# EAGLE design SRAM 4MB_2.2 (EAGLE 6.5.0)
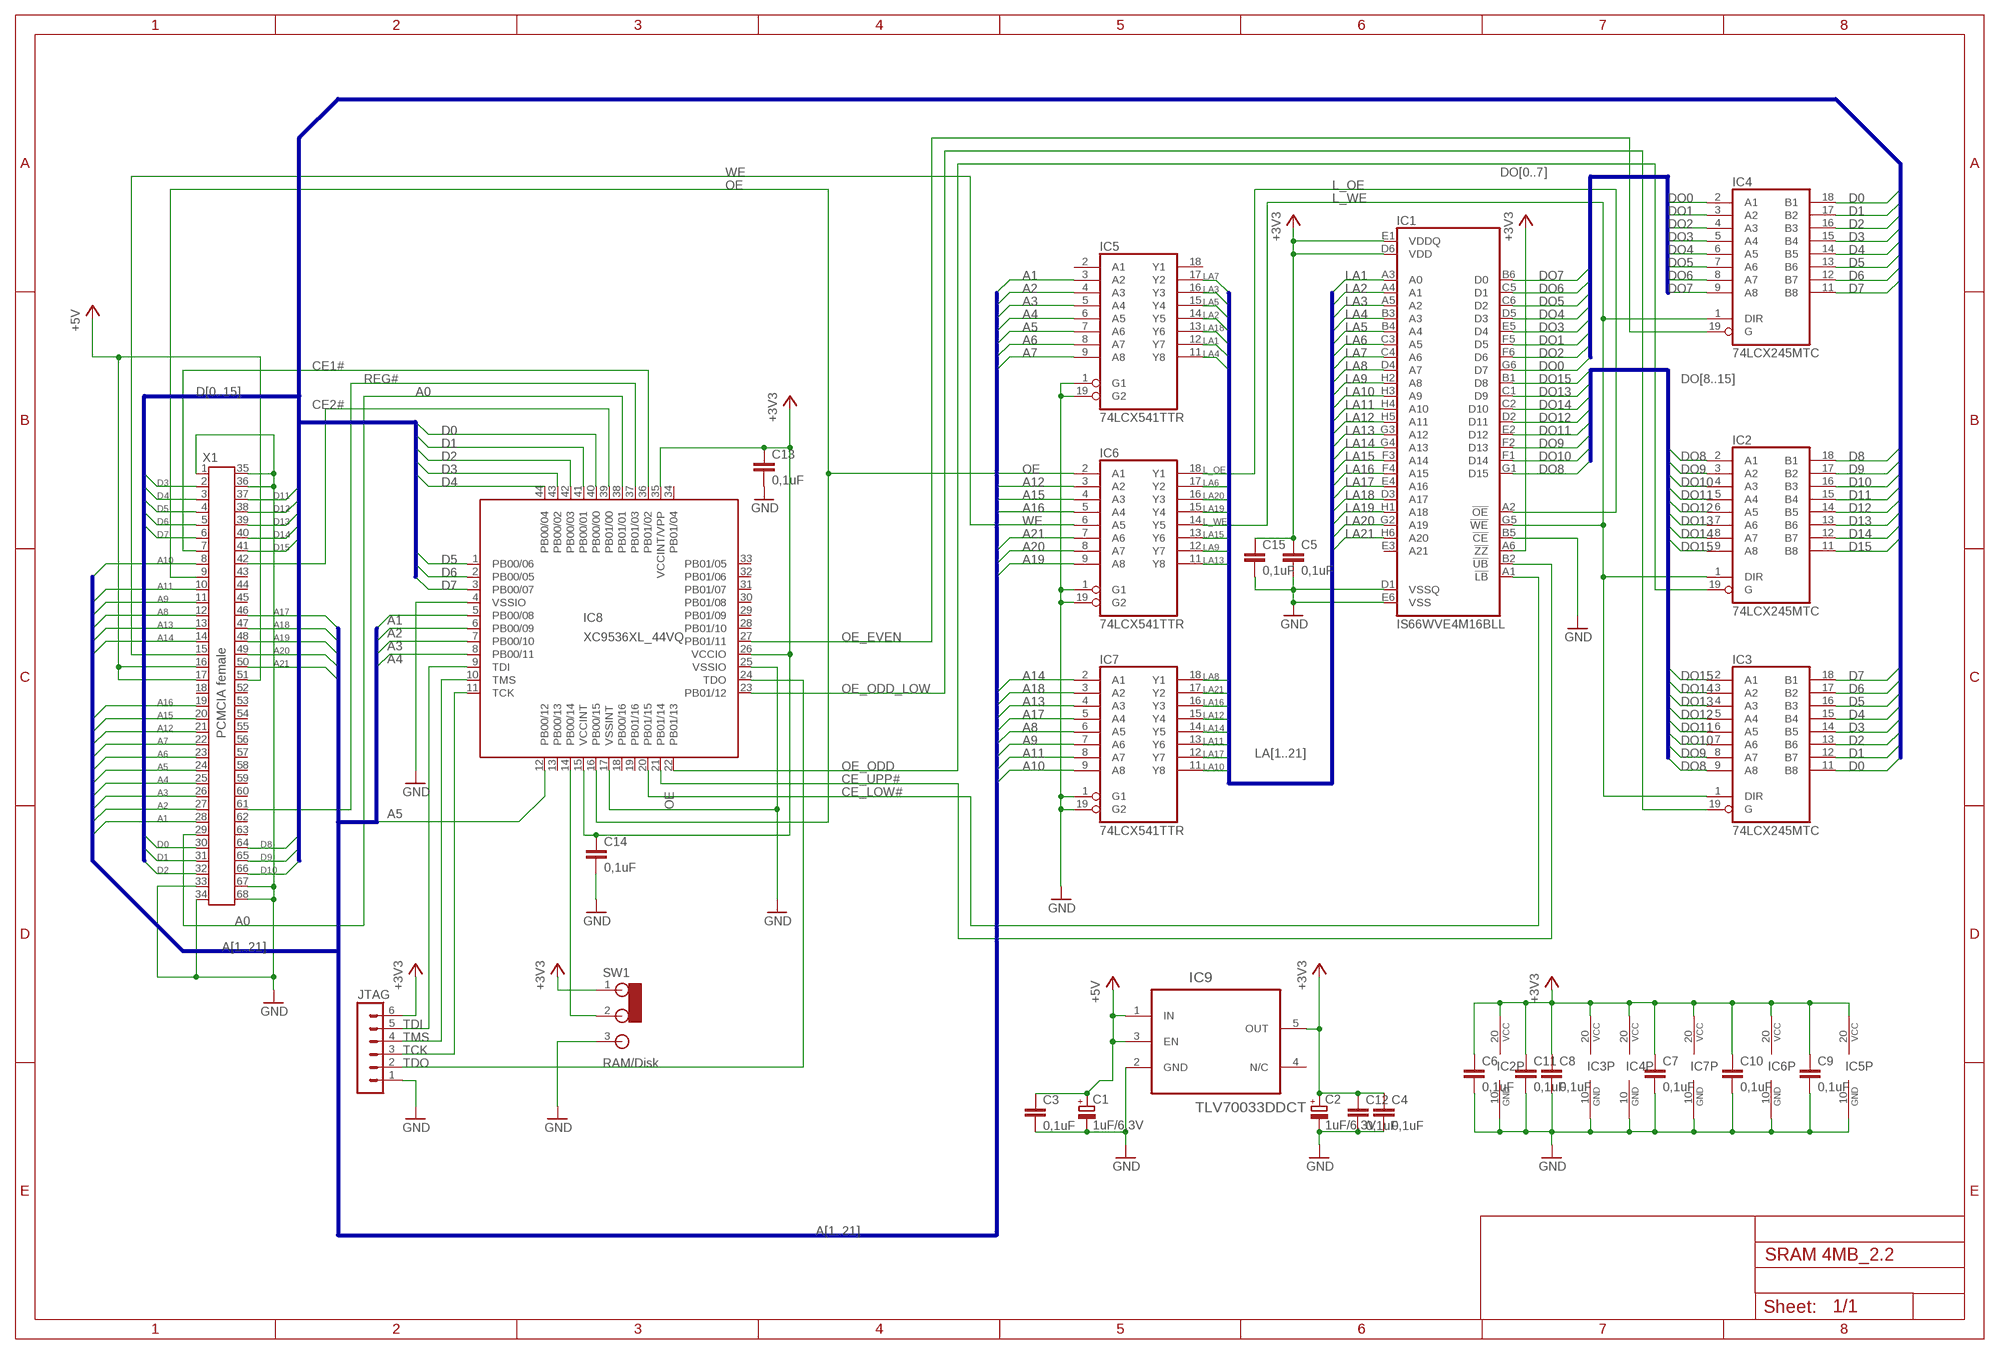
[diagram p0: schematic, sheet 1]

## Parts
C1  1uF/6,3V  CPOL-EUA/3216-18R  [A/3216-18R]
C2  1uF/6,3V  CPOL-EUA/3216-18R  [A/3216-18R]
C3  0,1uF  C-EUC0603  [C0603]
C4  0,1uF  C-EUC0603  [C0603]
C5  0,1uF  C-EUC0402K  [C0402K]
C6  0,1uF  C-EUC0402K  [C0402K]
C7  0,1uF  C-EUC0402K  [C0402K]
C8  0,1uF  C-EUC0402K  [C0402K]
C9  0,1uF  C-EUC0402K  [C0402K]
C10  0,1uF  C-EUC0402K  [C0402K]
C11  0,1uF  C-EUC0402K  [C0402K]
C12  0,1uF  C-EUC0402K  [C0402K]
C13  0,1uF  C-EUC0402K  [C0402K]
C14  0,1uF  C-EUC0402K  [C0402K]
C15  0,1uF  C-EUC0402K  [C0402K]
IC1  IS66WVE4M16BLL  [TFBGA48]
IC2  74LCX245MTC  74LS245MTC  [TSSOP20]
IC3  74LCX245MTC  74LS245MTC  [TSSOP20]
IC4  74LCX245MTC  74LS245MTC  [TSSOP20]
IC5  74LCX541TTR  74541TTR  [TSSOP20]
IC6  74LCX541TTR  74541TTR  [TSSOP20]
IC7  74LCX541TTR  74541TTR  [TSSOP20]
IC8  XC9536XL_44VQ  XC9536_44VQ  [SQFP-S-10X10-44]
IC9  TLV70033DDCT  [SOT95P280X110-5N]
JTAG  MA06-1  [MA06-1]
SW1  RAM/Disk  AYZ0102AGRLC  [SWITCH2]
X1  PCMCIA female  9M681X03TB9M681Z04  [9M681X04]

## Nets
+3V3 [+3.3V]: C2.+ C4.1 C5.1 C6.1 C7.1 C8.1 C9.1 C10.1 C11.1 C12.1 C13.1 C14.1 C15.1 IC1.A6(!ZZ) IC1.D6(VDD) IC1.E1(VDDQ) IC2.20(VCC) IC3.20(VCC) IC4.20(VCC) IC5.20(VCC) IC6.20(VCC) IC7.20(VCC) IC8.15(VCCINT) IC8.26(VCCIO) IC8.35(VCCINT/VPP) IC9.5(OUT) JTAG.6 SW1.1
+5V [+5V]: C1.+ C3.1 IC9.1(IN) IC9.3(EN) X1.16 X1.17 X1.51
A0: IC8.38(PB01/01) X1.29
A1: IC5.3(A2) IC8.5(PB00/08) X1.28
A2: IC5.4(A3) IC8.6(PB00/09) X1.27
A3: IC5.5(A4) IC8.7(PB00/10) X1.26
A4: IC5.6(A5) IC8.8(PB00/11) X1.25
A5: IC5.7(A6) IC8.12(PB00/12) X1.24
A6: IC5.8(A7) X1.23
A7: IC5.9(A8) X1.22
A8: IC7.6(A5) X1.12
A9: IC7.7(A6) X1.11
A10: IC7.9(A8) X1.8
A11: IC7.8(A7) X1.10
A12: IC6.3(A2) X1.21
A13: IC7.4(A3) X1.13
A14: IC7.2(A1) X1.14
A15: IC6.4(A3) X1.20
A16: IC6.5(A4) X1.19
A17: IC7.5(A4) X1.46
A18: IC7.3(A2) X1.47
A19: IC6.9(A8) X1.48
A20: IC6.8(A7) X1.49
A21: IC6.7(A6) X1.50
CE1#: IC8.36(PB01/02) X1.7
CE2#: IC8.39(PB01/00) X1.42
CE_LOW#: IC1.A1(!LB) IC8.20(PB01/15)
CE_UPP#: IC1.B2(!UB) IC8.21(PB01/14)
D0: IC3.11(B8) IC4.18(B1) IC8.40(PB00/00) X1.30
D1: IC3.12(B7) IC4.17(B2) IC8.41(PB00/01) X1.31
D2: IC3.13(B6) IC4.16(B3) IC8.42(PB00/03) X1.32
D3: IC3.14(B5) IC4.15(B4) IC8.43(PB00/02) X1.2
D4: IC3.15(B4) IC4.14(B5) IC8.44(PB00/04) X1.3
D5: IC3.16(B3) IC4.13(B6) IC8.1(PB00/06) X1.4
D6: IC3.17(B2) IC4.12(B7) IC8.2(PB00/05) X1.5
D7: IC3.18(B1) IC4.11(B8) IC8.3(PB00/07) X1.6
D8: IC2.18(B1) X1.64
D9: IC2.17(B2) X1.65
D10: IC2.16(B3) X1.66
D11: IC2.15(B4) X1.37
D12: IC2.14(B5) X1.38
D13: IC2.13(B6) X1.39
D14: IC2.12(B7) X1.40
D15: IC2.11(B8) X1.41
DO0: IC1.G6(D7) IC4.2(A1)
DO1: IC1.F5(D5) IC4.3(A2)
DO2: IC1.F6(D6) IC4.4(A3)
DO3: IC1.E5(D4) IC4.5(A4)
DO4: IC1.D5(D3) IC4.6(A5)
DO5: IC1.C6(D2) IC4.7(A6)
DO6: IC1.C5(D1) IC4.8(A7)
DO7: IC1.B6(D0) IC4.9(A8)
DO8: IC1.G1(D15) IC2.2(A1) IC3.9(A8)
DO9: IC1.F2(D13) IC2.3(A2) IC3.8(A7)
DO10: IC1.F1(D14) IC2.4(A3) IC3.7(A6)
DO11: IC1.E2(D12) IC2.5(A4) IC3.6(A5)
DO12: IC1.D2(D11) IC2.6(A5) IC3.5(A4)
DO13: IC1.C1(D9) IC2.7(A6) IC3.4(A3)
DO14: IC1.C2(D10) IC2.8(A7) IC3.3(A2)
DO15: IC1.B1(D8) IC2.9(A8) IC3.2(A1)
GND [Ground]: C1.- C2.- C3.2 C4.2 C5.2 C6.2 C7.2 C8.2 C9.2 C10.2 C11.2 C12.2 C13.2 C14.2 C15.2 IC1.B5(!CE) IC1.D1(VSSQ) IC1.E6(VSS) IC2.10(GND) IC3.10(GND) IC4.10(GND) IC5.1(G1) IC5.10(GND) IC5.19(G2) IC6.1(G1) IC6.10(GND) IC6.19(G2) IC7.1(G1) IC7.10(GND) IC7.19(G2) IC8.4(VSSIO) IC8.17(VSSINT) IC8.25(VSSIO) IC9.2(GND) JTAG.1 SW1.3 X1.1 X1.33 X1.34 X1.35 X1.36 X1.67 X1.68
L_OE: IC1.A2(!OE) IC6.18(Y1)
L_WE: IC1.G5(!WE) IC2.1(DIR) IC3.1(DIR) IC4.1(DIR) IC6.14(Y5)
LA1: IC1.A3(A0) IC5.12(Y7)
LA2: IC1.A4(A1) IC5.14(Y5)
LA3: IC1.A5(A2) IC5.16(Y3)
LA4: IC1.B3(A3) IC5.11(Y8)
LA5: IC1.B4(A4) IC5.15(Y4)
LA6: IC1.C3(A5) IC6.17(Y2)
LA7: IC1.C4(A6) IC5.17(Y2)
LA8: IC1.D4(A7) IC7.18(Y1)
LA9: IC1.H2(A8) IC6.12(Y7)
LA10: IC1.H3(A9) IC7.11(Y8)
LA11: IC1.H4(A10) IC7.13(Y6)
LA12: IC1.H5(A11) IC7.15(Y4)
LA13: IC1.G3(A12) IC6.11(Y8)
LA14: IC1.G4(A13) IC7.14(Y5)
LA15: IC1.F3(A14) IC6.13(Y6)
LA16: IC1.F4(A15) IC7.16(Y3)
LA17: IC1.E4(A16) IC7.12(Y7)
LA18: IC1.D3(A17) IC5.13(Y6)
LA19: IC1.H1(A18) IC6.15(Y4)
LA20: IC1.G2(A19) IC6.16(Y3)
LA21: IC1.H6(A20) IC7.17(Y2)
N$8: IC8.14(PB00/14) SW1.2
OE: IC6.2(A1) IC8.16(PB00/15) X1.9
OE_EVEN: IC4.19(G) IC8.27(PB01/11)
OE_ODD: IC2.19(G) IC8.22(PB01/13)
OE_ODD_LOW: IC3.19(G) IC8.23(PB01/12)
REG#: IC8.37(PB01/03) X1.61
TCK: IC8.11(TCK) JTAG.3
TDI: IC8.9(TDI) JTAG.5
TDO: IC8.24(TDO) JTAG.2
TMS: IC8.10(TMS) JTAG.4
WE: IC6.6(A5) X1.15
Unconnected: IC1.E3(A21) IC5.2(A1) IC5.18(Y1) IC8.13(PB00/13) IC8.18(PB00/16) IC8.19(PB01/16) IC8.28(PB01/10) IC8.29(PB01/09) IC8.30(PB01/08) IC8.31(PB01/07) IC8.32(PB01/06) IC8.33(PB01/05) IC8.34(PB01/04) IC9.4(N/C) X1.18 X1.43 X1.44 X1.45 X1.52 X1.53 X1.54 X1.55 X1.56 X1.57 X1.58 X1.59 X1.60 X1.62 X1.63

## Buses
DO[8..15]
DO[0..7]
D[0..15]
A[1..21]
LA[1..21]

## Library data of the parts
C1 C2 = resistor:CPOL-EU: POLARIZED CAPACITOR, European symbol
C3-C15 = resistor:C-EU: CAPACITOR, European symbol
IC1 = ISSI_By_element14_Batch_1:IS66WVE4M16BLL: 4M words by 16 bits PSRAM
IC2-IC4 = 74xx-us:74*245: Octal BUS TRANSCEIVER, 3-state
IC5-IC7 = 74xx-us:74*541: Octal BUFFER and LINE DRIVER, 3-state
IC8 = xilinx-xc9:XC9536_44VQ: xc9536_pc44 XC9500 In-System Programmable CPLD Family Auto generated by make-symbol-device-package-bsdl.ulp Rev. 34 Source: xc9536_vq44.bsd; MPN: XC9536-15VQG44C; OC_FARNELL: 1193227; OC_NEWARK: 98K3377
IC9 = _V-reg33V:TLV70033DDCT: 200-mA, Low-IQ, Low-Dropout Regulator for Portable Devices; MPN: TLV70033DDCT; OC_FARNELL: 1778230; OC_NEWARK: 50R4446; PACKAGE: TSOT-23-5; SUPPLIER: Texas Instruments
JTAG = con-lstb:MA06-1: PIN HEADER; OC_FARNELL: unknown; OC_NEWARK: unknown
SW1 = amiga:AYZ0102AGRLC: SWITCH
X1 = 3M:9M681X03TB

## Net classes
0 default: width 0.102 mm
1 Ground: width 0.254 mm
2 +5V: width 0.254 mm
3 +3.3V: width 0.254 mm

## Board
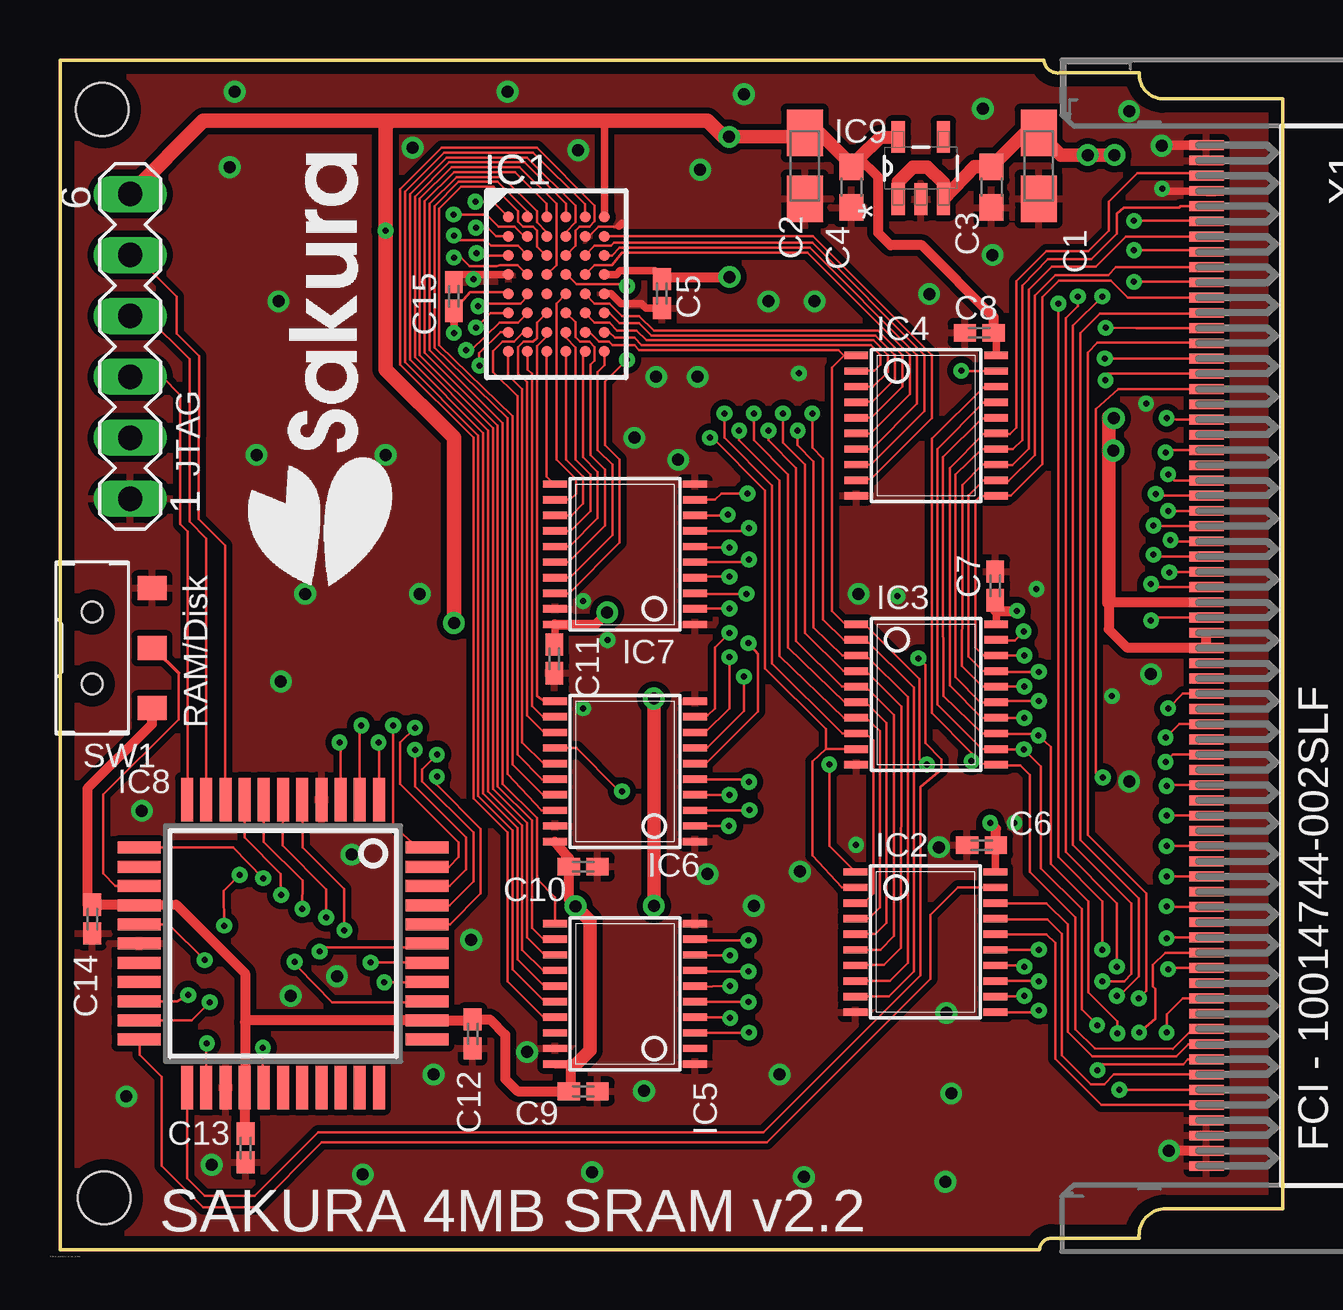
[diagram p1: board, top side]
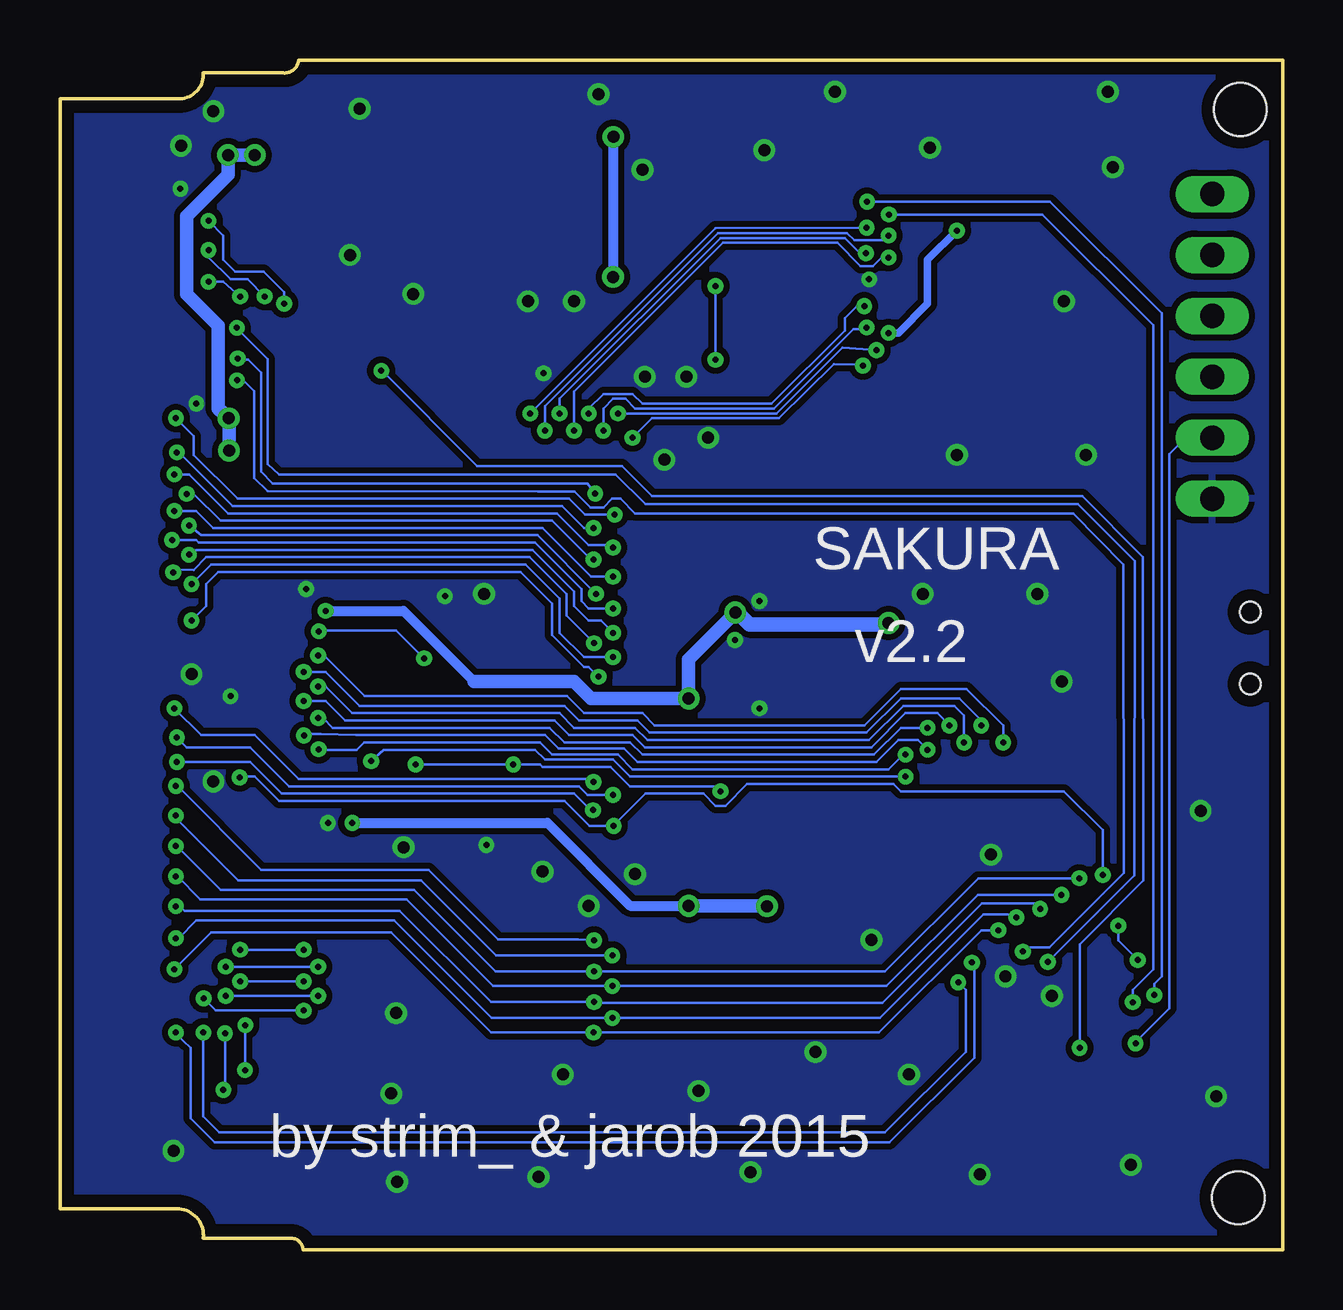
[diagram p2: board, bottom side, seen from below]

Size 50.96 x 49.6 mm. Coordinates in mm from the lower left corner, seen from the top.
Outline: 0,0 40.83,0 arc-90 41.35,0.49 44.98,0.49 arc-90 45.99,1.71 50.96,1.71 50.96,47.98 45.94,47.98 arc-90 44.98,49.06 41.65,49.06 arc-90 41.01,49.6 0,49.6 0,0
Copper layers (1*16): Top 0.035mm / dielectric 1.5mm / Bottom 0.035mm
Design rules "default *": minimum track width 0.015mm, minimum drill 0.25mm, track to track 4mil, track to pad 4mil, pad to pad 4mil, via to via 6mil, smd to smd 4mil, copper to edge 20mil, drill to drill 8mil, minimum pad ring 10mil, minimum via ring 8mil, stop-mask expansion 4mil, vias tented up to drill 20mil, thermal gap 10mil
Holes 2.2 mm at 1.85,2.17 1.76,47.54

### Footprints (pad centres in the part's own frame; a part is rotated, then mirrored left to right if it is on the bottom)
A/3216-18R = smd 1.95 x 1.5: + 1.375,0; - -1.375,0
C0603 = smd 1.1 x 1: 1 -0.85,0; 2 0.85,0
C0402K = smd 0.925 x 0.74: 1 -0.6,0; 2 0.6,0
TFBGA48 = smd 0.45 x 0.45: A1 -2,2.8; A2 -1.2,2.8; A3 -0.4,2.8; A4 0.4,2.8; A5 1.2,2.8; A6 2,2.8; B1 -2,2; B2 -1.2,2; B3 -0.4,2; B4 0.4,2; B5 1.2,2; B6 2,2; C1 -2,1.2; C2 -1.2,1.2; C3 -0.4,1.2; C4 0.4,1.2; C5 1.2,1.2; C6 2,1.2; D1 -2,0.4; D2 -1.2,0.4; D3 -0.4,0.4; D4 0.4,0.4; D5 1.2,0.4; D6 2,0.4; E1 -2,-0.4; E2 -1.2,-0.4; E3 -0.4,-0.4; E4 0.4,-0.4; E5 1.2,-0.4; E6 2,-0.4; F1 -2,-1.2; F2 -1.2,-1.2; F3 -0.4,-1.2; F4 0.4,-1.2; F5 1.2,-1.2; F6 2,-1.2; G1 -2,-2; G2 -1.2,-2; G3 -0.4,-2; G4 0.4,-2; G5 1.2,-2; G6 2,-2; H1 -2,-2.8; H2 -1.2,-2.8; H3 -0.4,-2.8; H4 0.4,-2.8; H5 1.2,-2.8; H6 2,-2.8
TSSOP20 = smd 0.305 x 0.991: 1 -2.925,-2.918; 2 -2.275,-2.918; 3 -1.625,-2.918; 4 -0.975,-2.918; 5 -0.325,-2.918; 6 0.325,-2.918; 7 0.975,-2.918; 8 1.625,-2.918; 9 2.275,-2.918; 10 2.925,-2.918; 11 2.925,2.918; 12 2.275,2.918; 13 1.625,2.918; 14 0.975,2.918; 15 0.325,2.918; 16 -0.325,2.918; 17 -0.975,2.918; 18 -1.625,2.918; 19 -2.275,2.918; 20 -2.925,2.918
SQFP-S-10X10-44 = smd 0.5 x 1.8: 1 -4,-6; 2 -3.2,-6; 3 -2.4,-6; 4 -1.6,-6; 5 -0.8,-6; 6 0,-6; 7 0.8,-6; 8 1.6,-6; 9 2.4,-6; 10 3.2,-6; 11 4,-6; 23 4,6; 24 3.2,6; 25 2.4,6; 26 1.6,6; 27 0.8,6; 28 0,6; 29 -0.8,6; 30 -1.6,6; 31 -2.4,6; 32 -3.2,6; 33 -4,6 | smd 1.8 x 0.5: 12 6,-4; 13 6,-3.2; 14 6,-2.4; 15 6,-1.6; 16 6,-0.8; 17 6,0; 18 6,0.8; 19 6,1.6; 20 6,2.4; 21 6,3.2; 22 6,4; 34 -6,4; 35 -6,3.2; 36 -6,2.4; 37 -6,1.6; 38 -6,0.8; 39 -6,0; 40 -6,-0.8; 41 -6,-1.6; 42 -6,-2.4; 43 -6,-3.2; 44 -6,-4
SOT95P280X110-5N = smd 1.321 x 0.559: 1 -1.295,0.94; 2 -1.295,0; 3 -1.295,-0.94; 4 1.295,-0.94; 5 1.295,0.94
MA06-1 = drill 1.016 long: 1 -6.35,0; 2 -3.81,0; 3 -1.27,0; 4 1.27,0; 5 3.81,0; 6 6.35,0
SWITCH2 = smd 1 x 1.2: 1 -2.5,1; 2 0,1; 3 2.5,1 | hole 0.85: -1.5,3.5; 1.5,3.5
9M681X04 = smd 0.406 x 1.422: 1 -20.955,-3.175; 2 -19.685,-3.175; 3 -18.415,-3.175; 4 -17.145,-3.175; 5 -15.875,-3.175; 6 -14.605,-3.175; 7 -13.335,-3.175; 8 -12.065,-3.175; 9 -10.795,-3.175; 10 -9.525,-3.175; 11 -8.255,-3.175; 12 -6.985,-3.175; 13 -5.715,-3.175; 14 -4.445,-3.175; 15 -3.175,-3.175; 16 -1.905,-3.175; 17 -0.635,-3.175; 18 0.635,-3.175; 19 1.905,-3.175; 20 3.175,-3.175; 21 4.445,-3.175; 22 5.715,-3.175; 23 6.985,-3.175; 24 8.255,-3.175; 25 9.525,-3.175; 26 10.795,-3.175; 27 12.065,-3.175; 28 13.335,-3.175; 29 14.605,-3.175; 30 15.875,-3.175; 31 17.145,-3.175; 32 18.415,-3.175; 33 19.685,-3.175; 34 20.955,-3.175; 35 -20.32,-3.175; 36 -19.05,-3.175; 37 -17.78,-3.175; 38 -16.51,-3.175; 39 -15.24,-3.175; 40 -13.97,-3.175; 41 -12.7,-3.175; 42 -11.43,-3.175; 43 -10.16,-3.175; 44 -8.89,-3.175; 45 -7.62,-3.175; 46 -6.35,-3.175; 47 -5.08,-3.175; 48 -3.81,-3.175; 49 -2.54,-3.175; 50 -1.27,-3.175; 51 0,-3.175; 52 1.27,-3.175; 53 2.54,-3.175; 54 3.81,-3.175; 55 5.08,-3.175; 56 6.35,-3.175; 57 7.62,-3.175; 58 8.89,-3.175; 59 10.16,-3.175; 60 11.43,-3.175; 61 12.7,-3.175; 62 13.97,-3.175; 63 15.24,-3.175; 64 16.51,-3.175; 65 17.78,-3.175; 66 19.05,-3.175; 67 20.32,-3.175; 68 21.59,-3.175

### Placement (x,y rotation side)
C1  40.79,45.19 90 top
C2  31.05,45.19 90 top
C3  38.82,44.3 270 top
C4  32.98,44.3 270 top
C5  25.09,39.86 270 top
C6  38.41,16.87 180 top
C7  38.98,27.68 90 top
C8  38.32,38.23 180 top
C9  21.81,6.61 0 top
C10  21.81,15.98 0 top
C11  20.61,24.64 270 top
C12  17.2,9 270 top
C13  7.74,4.25 270 top
C14  1.35,13.79 270 top
C15  16.42,39.74 90 top
IC1  20.69,40.25 0 top
IC2  36.07,12.83 270 top
IC3  36.11,23.15 270 top
IC4  36.11,34.36 270 top
IC5  23.55,10.67 90 top
IC6  23.55,19.95 90 top
IC7  23.55,28.99 90 top
IC8  9.3,12.77 180 top
IC9  35.88,45.09 90 top
JTAG  2.93,37.66 90 top
SW1  4.84,25.09 90 top
X1  50.97,25.09 270 top

### Tracks (layer width: path | path; a pad name or v marks a point on that pad's centre or on a via)
+3V3  (via drill 0.25, 0.5)
  Top 0.102: C15.1 17.1,39.92 18.57,39.92 IC1.E1
  Top 0.305: 3.27,14.39 IC8.15 | IC8.26 | 7.78,9.57 7.71,9.5 | 17.47,9.57 C12.1 | IC5.20 | IC5.20 21.28,7.76 | 7.7,4.59 C13.1 | 1.14,14.4 C14.1 | C11.1 20.67,25.22 IC7.20 | IC5.20 20.66,7.72 21.49,7.72 | IC4.20 39.02,38.02 C8.1 | IC3.20 39.02,26.94 C7.1 | IC2.20 38.99,16.75 C6.1 | IC1.A6 22.69,47.06 22.62,47.06 | C15.1 v16.42,38.22 | IC1.D6 23.2,40.65 23.34,40.81 24.8,40.81 C5.1
  Top 0.406: 33,45.2 33,45.13 C4.1 33.17,45.05 | 31.05,46.5 C2.+ | C14.1 3.27,14.39 | IC8.15 4.84,14.4 7.71,11.53 7.71,9.5 IC8.26 | 7.78,9.57 IC8.35 17.47,9.57 | C12.1 17.92,9.6 18.56,8.97 18.56,7.13 19.08,6.61 C9.1 21.25,6.61 21.28,6.64 21.28,7.72 21.3,7.74 21.28,7.76 | IC8.26 7.7,4.59 | SW1.1 3.83,21.9 1.14,19.23 1.14,14.4 | IC6.20 21.21,16.35 C10.1 21.21,14.61 v21.49,14.33 | 30.95,46.4 29.32,46.39 31.46,46.39 31.46,46.35 30.8,46.4 | IC7.20 22.32,26.07 v22.81,26.57 | C7.1 38.99,26.64 v39.89,26.64 | C6.1 39.01,17.56 v38.77,17.8 | v27.9,46.4 v27.9,46.39 | 33.31,45.51 34.11,44.71 34.11,42.39 34.62,41.88 35.93,41.88 38.92,38.89 C8.1 | C5.1 25.19,40.56 v27.9,40.56
  Top 0.559: IC9.5 34.17,46.37 33.31,45.51 33,45.2 | 33.17,45.05 31.73,46.5 31.05,46.5 30.95,46.4 | v21.49,14.33 22.09,13.72 22.09,8.32 21.49,7.72 | v24.75,22.98 v24.75,14.34 | 30.8,46.4 v27.9,46.4
  Top 0.61: 2.96,44.04 JTAG.6 | 2.96,44.04 3.28,44.04 | 2.96,44.04 5.98,47.06 13.78,47.06 | 13.78,47.06 22.62,47.06 26.99,47.06 27.65,46.39 v27.9,46.39 | v16.42,26.13 16.42,33.85 13.58,36.7 v13.58,42.49 13.58,46.86 13.78,47.06
  Bottom 0.305: v16.42,38.22 16.02,38.22 14.8,39.44 14.8,41.27 v13.58,42.49
  Bottom 0.406: v39.89,26.64 36.64,26.64 33.69,23.69 | v38.77,17.8 30.65,17.8 27.19,14.34 v24.75,14.34 | v27.9,40.56 v27.9,46.39
  Bottom 0.559: 33.69,23.69 29.53,23.69 28.82,22.98 v24.75,22.98 24.75,24.61 v22.81,26.57 | v24.75,14.34 21.39,14.34 21.5,14.33 v21.49,14.33
  Bottom 0.61: v22.81,26.57 22.71,26.57 22.21,26.07 16.48,26.07 arc-90 v16.42,26.13
+5V  (via drill 0.5)
  Top 0.406: 47.69,25.72 X1.17 X1.51 47.77,25.11 44.46,25.11 43.71,25.86 43.71,26.99 X1.16 | C1.+ 40.23,46.56 | 43.71,34.73 v43.92,34.66
  Top 0.559: 40.23,46.56 C3.1 38.12,45.15 IC9.3 36.82,44.48 36.16,45.14 35.55,45.14 34.94,44.53 IC9.1 | 43.71,26.99 43.71,34.73 | v43.96,45.64 41.72,45.64 C1.+
  Bottom 0.406: v43.92,34.66 43.91,34.74
  Bottom 0.559: v43.92,34.66 44.36,35.07 44.36,38.53 45.68,39.85 45.68,43.1 43.96,44.82 v43.96,45.64 v42.84,45.64 | 43.91,34.74 v43.91,33.32
A0  (via drill 0.25)
  Top 0.102: X1.29 46.8,10.48 46.13,9.81 v46.13,9.06 | v12.95,11.98 IC8.38
  Top 0.15: IC8.38
  Bottom 0.102: v46.13,9.06 46.13,9 45.52,8.43 45.52,5.49 44.51,4.48 16.38,4.48 12.85,8.01 12.85,11.88
  Bottom 0.15: 12.85,11.88 v12.95,11.98
A1  (via drill 0.25)
  Top 0.102: X1.28 46.19,11.75 v46.19,11.7 | v28.72,9.06 28.7,9.05 IC5.3 | IC8.5 10.12,18.74 10.12,16.78 11.85,15.06 v11.85,13.33
  Bottom 0.102: v46.19,11.7 44.67,13.23 37.15,13.23 32.98,9.06 v28.72,9.06 16.83,9.06 12.56,13.33 v11.85,13.33
A2  (via drill 0.25)
  Top 0.102: X1.27 46.16,13.02 v46.13,12.99 | IC8.6 9.28,16.87 11.09,15.03 v11.09,13.86 | IC5.4 27.93,9.7 v27.93,9.66
  Bottom 0.102: v46.13,12.99 46.02,12.99 45.28,13.73 37.03,13.73 32.96,9.66 v27.93,9.66 16.78,9.66 12.47,13.98 11.44,13.98 v11.09,13.86
A3  (via drill 0.25)
  Top 0.102: X1.26 46.16,14.29 v46.13,14.33 | IC8.7 8.5,17.01 10.11,15.39 v10.1,14.22 | IC5.5 28.7,10.35 v28.7,10.33
  Bottom 0.102: v46.13,14.33 45.94,14.33 45.75,14.14 36.8,14.14 32.99,10.33 v28.7,10.33 28.67,10.3 16.68,10.3 12.53,14.45 10.33,14.45 v10.1,14.22
A4  (via drill 0.25)
  Top 0.102: X1.25 v46.13,15.56 | IC8.8 7.7,17.19 9.21,15.67 9.21,14.82 v9.21,14.8 | v27.93,11 26.47,10.97 IC5.6
  Bottom 0.102: v46.13,15.56 46.06,15.56 45.12,14.62 36.51,14.62 32.9,11 28.61,11 v27.93,11 16.5,11 12.7,14.8 v9.21,14.8
A5  (via drill 0.25)
  Top 0.102: X1.24 v46.13,16.83 | IC8.12 7.21,16.77 v8.46,15.49 | v28.7,11.6 26.47,11.6 IC5.7
  Bottom 0.102: v46.13,16.83 46.1,16.83 44.26,15 36.2,15 32.8,11.6 v28.7,11.6 16.57,11.6 12.68,15.49 v8.46,15.49
A6  (via drill 0.25)
  Top 0.102: X1.23 v46.13,18.1 | v27.93,12.27 26.47,12.27 IC5.8
  Bottom 0.102: v46.13,18.1 46.13,18.01 43.52,15.4 35.92,15.4 32.78,12.27 v27.93,12.27
A7  (via drill 0.25)
  Top 0.102: X1.22 46.16,19.37 v46.13,19.34 | v28.7,12.9 26.47,12.9 IC5.9
  Bottom 0.102: v46.13,19.34 46.06,19.34 42.57,15.85 35.6,15.85 32.69,12.94 29.38,12.94 v28.7,12.9
A8  (via drill 0.25)
  Top 0.102: X1.12 46.44,32.07 v46.19,32.33 | v27.9,29.28 26.51,29.28 IC7.6
  Bottom 0.102: v46.19,32.33 45.58,32.33 43.96,30.7 30.24,30.7 28.92,29.38 28,29.38 v27.9,29.28
A9  (via drill 0.25)
  Top 0.102: X1.11 46.19,33.34 v46.09,33.24 | v28.72,30.09 28.59,29.97 IC7.7
  Bottom 0.102: v46.09,33.24 45.99,33.24 43.75,31.01 30.04,31.01 29.12,30.09 v28.72,30.09
A10  (via drill 0.25)
  Top 0.102: X1.8 44.93,37.15 v43.56,37.16 | v28.65,31.53 27.57,31.53 27.31,31.27 IC7.9
  Bottom 0.102: v43.56,37.16 43.55,37.1 43.11,37.1 42.57,36.57 42.57,32.44 42.09,31.95 28.98,31.95 v28.65,31.53
A11  (via drill 0.25)
  Top 0.102: X1.10 46.54,34.61 v46.13,34.68 | IC7.8 27.81,30.62 v27.84,30.64
  Bottom 0.102: v27.84,30.64 29.06,30.64 29.73,31.31 43.55,31.31 45.38,33.14 45.38,33.93 v46.13,34.68
A12  (via drill 0.25)
  Top 0.102: X1.21 46.39,20.64 v46.09,20.34 | IC6.3 28.73,18.32 v28.74,18.33
  Bottom 0.102: v46.09,20.34 43.04,20.34 41.72,19.02 29.53,19.02 28.84,18.33 v28.74,18.33
A13  (via drill 0.25)
  Top 0.102: X1.13 v46.19,30.8 | v27.9,28.06 26.51,28.06 IC7.4
  Bottom 0.102: v46.19,30.8 45.28,30.8 44.56,30.09 30.85,30.09 28.82,28.06 v27.9,28.06
A14  (via drill 0.25)
  Top 0.102: X1.14 46.34,29.53 v46.29,29.58 | v27.9,26.74 26.49,26.74 IC7.2
  Bottom 0.102: v46.29,29.58 45.28,29.58 45.17,29.48 31.15,29.48 29.22,27.55 29.22,27.04 28.92,26.74 v27.9,26.74
A15  (via drill 0.25)
  Top 0.102: X1.20 46.65,21.91 v46.09,21.35 | IC6.4 v27.9,18.97
  Bottom 0.102: v46.09,21.35 45.68,20.95 43.04,20.95 41.42,19.32 29.32,19.32 28.97,18.97 v27.9,18.97
A16  (via drill 0.25)
  Top 0.102: X1.19 46.8,23.18 v46.19,22.57 | IC6.5 28.6,19.62 v28.72,19.5
  Bottom 0.102: v46.19,22.57 45.07,21.46 42.84,21.46 41.01,19.63 28.84,19.63 v28.72,19.5
A17  (via drill 0.25)
  Top 0.102: X1.46 45.76,31.44 v45.68,31.51 | v28.72,28.77 28.61,28.67 IC7.5
  Bottom 0.102: v45.68,31.51 45.38,31.51 44.26,30.4 30.44,30.4 28.82,28.77 v28.72,28.77
A18  (via drill 0.25)
  Top 0.102: X1.47 45.61,30.17 v45.58,30.19 | v28.61,27.35 26.49,27.35 IC7.3
  Bottom 0.102: v45.58,30.19 45.07,29.79 31.05,29.79 v28.61,27.35
A19  (via drill 0.25)
  Top 0.102: X1.48 45.61,28.9 v45.58,28.97 | v27.9,25.72 27.29,25.11 27.29,22.57 26.99,22.27 26.52,22.27 IC6.9
  Bottom 0.102: v45.58,28.97 45.28,29.18 31.26,29.18 29.53,27.45 29.53,26.84 28.92,26.23 28.41,26.23 v27.9,25.72
A20  (via drill 0.25)
  Top 0.102: X1.49 45.5,27.63 v45.48,27.76 | v27.9,24.71 27.9,22.57 26.89,21.56 26.48,21.56 IC6.8
  Bottom 0.102: v45.48,27.76 44.67,28.57 31.56,28.57 30.14,27.15 30.14,25.72 29.12,24.71 v27.9,24.71
A21  (via drill 0.25)
  Top 0.102: X1.50 45.61,26.36 v45.48,26.23 | v28.51,23.89 28.51,22.47 26.99,20.95 26.5,20.95 IC6.7
  Bottom 0.102: v45.48,26.23 44.87,26.84 44.87,27.76 44.36,28.26 31.76,28.26 30.44,26.94 30.44,25.62 29.12,24.3 28.92,24.3 v28.51,23.89
CE1#  (via drill 0.25)
  Top 0.102: X1.7 44.87,38.42 v43.59,38.43 | v9.78,12.01 9.93,11.77 11.35,10.32 15.25,10.32
  Top 0.15: 15.25,10.32 IC8.36
  Bottom 0.102: v43.59,38.43 43.56,38.39 42.3,37.14 42.3,32.76 41.83,32.31 27.8,32.33 26.56,31.09 8.53,31.09 6.17,28.72 6.17,15.61 v9.78,12.01
CE2#  (via drill 0.25)
  Top 0.102: v10.82,12.43 10.94,12.62 15.14,12.62 15.27,12.74 | X1.42 43.65,36.52 v43.58,36.25
  Top 0.15: 15.27,12.74 IC8.39
  Bottom 0.102: v43.58,36.25 43.4,36.35 42.86,35.8 42.86,32.18 42.31,31.63 31.03,31.62 29.5,31.62 28.84,30.95 28.3,30.95 27.95,31.31 27.6,31.31 26.99,30.7 8.73,30.7 6.63,28.57 6.61,15.72 9.72,12.61 10.64,12.62 v10.82,12.43
CE_LOW#  (via drill 0.25)
  Top 0.102: IC8.20 4.89,10.37 v5.35,10.62 | v17.32,43.69 18.05,43.69 IC1.A1
  Bottom 0.102: v5.35,10.62 5.35,11.09 5.04,11.4 5.04,39.04 9.7,43.69 v17.32,43.69
CE_UPP#  (via drill 0.25)
  Top 0.102: IC8.21 5.49,9.57 v6.24,10.32 | v16.4,43.16 17.78,43.16 18.29,42.65 18.95,42.65 19.35,42.25 IC1.B2
  Bottom 0.102: v6.24,10.32 6.24,10.84 5.39,11.69 5.39,38.55 10,43.16 v16.4,43.16
D0  (via drill 0.25)
  Top 0.102: IC4.18 38.99,35.95 38.49,35.95 36.34,33.82 36.34,22.37 38,20.71 v38,20.37 38.15,20.32 38.65,20.23 IC3.11 39.05,20.2 40.04,20.2 40.43,19.81 40.43,15.75 42.32,13.86 42.32,9.2 43.14,8.4 46.39,8.39 47.22,9.21 X1.30 | IC8.40 16.26,13.57 17.54,14.85 17.54,17.55 15.67,19.42 15.67,19.69 v15.71,19.73
  Bottom 0.102: v15.71,19.73 27.19,19.73 27.9,20.44 30.75,20.44 31.15,20.85 37.47,20.85 v38,20.37
D1  (via drill 0.25)
  Top 0.102: IC4.17 39,35.31 38.49,35.31 36.57,33.38 36.57,25.76 36.58,25.08 36.58,22.73 38.43,20.88 IC3.12 39.04,20.87 v40.18,20.87 40.88,20.16 40.88,15.9 42.59,14.2 42.59,10.02 43.13,9.48 v43.23,9.37 | X1.31 47,7.94 46.82,7.74 43.45,7.74 43.26,7.56 v43.25,7.49 | IC8.41 16.24,14.37 17.23,15.36 17.23,17.39 15.1,19.53 15.1,20.03 v15.71,20.64
  Bottom 0.102: v43.25,7.49 43.25,9.34 v43.23,9.37 | v15.71,20.64 15.81,20.64 16.42,20.03 27.09,20.03 27.7,20.64 30.44,20.64 30.95,21.15 38.28,21.15 38.59,20.85 40.2,20.85 40.2,20.87 v40.18,20.87
D2  (via drill 0.25)
  Top 0.102: IC4.16 38.99,34.65 38.42,34.65 36.81,33.04 36.81,25.83 36.82,25.24 36.82,23.09 38.45,21.53 IC3.13 39.05,21.5 40.55,21.5 | X1.32 v44.15,6.67 | v44.08,9.03 44.08,9.52 42.86,10.74 42.86,14.52 41.3,16.08 41.3,20.95 v40.79,21.45 | v40.79,21.45 40.55,21.5 | 40.55,21.5 40.7,21.5 40.73,21.49 v40.79,21.45 | IC8.42 16.23,15.17 16.93,15.87 16.93,17.19 14.8,19.32 v14.8,20.85
  Bottom 0.102: v44.15,6.67 44.08,6.74 v44.08,9.03 | v40.79,21.45 40.53,21.5 40.09,21.5 38.61,21.46 30.75,21.46 30.19,20.9 27.45,20.9 26.89,20.34 16.93,20.34 16.02,21.25 15.2,21.25 v14.8,20.85
D3  (via drill 0.25)
  Top 0.102: IC8.43 16.22,15.97 16.62,16.38 16.62,16.99 14.19,19.42 14.19,21.15 v14.8,21.76 | v40.2,22.17 39.03,22.17 IC3.14 38.43,22.18 37.08,23.54 37.08,32.59 38.49,34.01 39,34.01 IC4.15 39.05,34.01 39.59,34.01 39.87,34.28 39.87,40.37 41.12,41.63 42.86,41.63 43.72,42.49 43.72,43.69 44.91,44.88 47.69,44.88 X1.2
  Bottom 0.102: v14.8,21.76 15.91,21.76 17.03,20.64 26.68,20.64 27.19,21.15 29.93,21.15 30.54,21.76 39.59,21.76 39.99,22.17 v40.2,22.17
D4  (via drill 0.25)
  Top 0.102: X1.3 46.7,43.5 46.65,43.45 44.34,43.45 44.06,43.2 44.06,42.35 42.99,41.29 41.18,41.29 40.11,40.19 40.11,33.76 39.73,33.38 39.03,33.38 IC4.14 38.42,33.38 37.33,32.31 37.33,25.93 37.33,25.56 37.33,23.87 38.36,22.83 IC3.15 39.08,22.88 v40.81,22.88 | IC8.44 14.91,16.77 13.88,17.7 v13.88,21.86
  Bottom 0.102: v40.81,22.88 39.89,22.88 39.08,22.07 30.34,22.07 29.73,21.46 27.09,21.46 26.58,20.95 17.13,20.95 15.71,22.37 14.39,22.37 v13.88,21.86
D5  (via drill 0.25)
  Top 0.102: X1.4 44.44,42.23 43.19,40.98 41.34,40.98 40.39,40.02 40.39,33.4 39.69,32.71 39.05,32.71 IC4.13 38.46,32.74 37.61,31.88 37.61,26.03 37.6,25.7 37.6,24.35 38.44,23.48 IC3.16 39.04,23.49 v40.2,23.49 | IC8.1 13.3,21.13 v13.27,21.15
  Bottom 0.102: v13.27,21.15 13.27,22.27 13.68,22.68 15.81,22.68 17.23,21.25 26.48,21.25 26.99,21.76 29.53,21.76 30.14,22.37 38.77,22.37 39.89,23.49 v40.2,23.49
D6  (via drill 0.25)
  Top 0.102: X1.5 44.01,40.96 43.69,40.64 41.49,40.64 40.63,39.78 40.63,33.14 39.54,32.04 39.07,32.04 IC4.12 38.49,32.07 37.86,31.44 37.86,26.14 37.86,25.83 37.86,24.73 38.47,24.13 IC3.17 39.05,24.1 v40.81,24.1 | IC8.2 12.5,21.8 v12.56,21.86
  Bottom 0.102: 12.56,21.76 v12.56,21.86 12.56,22.07 13.48,22.98 15.91,22.98 17.34,21.56 26.38,21.56 26.89,22.07 29.32,22.07 29.93,22.68 38.47,22.68 39.89,24.1 v40.81,24.1
D7  (via drill 0.25)
  Top 0.102: X1.6 44.5,39.7 43.8,40.4 41.64,40.4 40.95,39.71 40.95,32.75 39.63,31.44 IC4.11 39,31.41 38.37,31.41 38.16,31.21 38.16,25.11 38.5,24.78 IC3.18 | IC8.3 11.7,21.1 v11.65,21.15 | IC3.18 v40.2,24.78 | IC3.18 40.27,24.78
  Bottom 0.102: v11.65,21.15 11.65,21.86 13.17,23.39 15.91,23.39 17.44,21.86 26.18,21.86 26.68,22.37 29.12,22.37 29.83,23.08 38.27,23.08 39.89,24.71 40.13,24.71 v40.2,24.78
D8
  Top 0.102: X1.64 47.04,8.58 46.54,8.07 43.03,8.07 42.01,9.09 42.01,13.56 41.12,14.45 IC2.18
D9
  Top 0.102: X1.65 43.93,7.31 43.52,6.9 42.97,6.9 41.76,8.11 41.76,13.18 41.15,13.79 39.02,13.79 IC2.17
D10
  Top 0.102: X1.66 43.42,6.04 41.48,7.97 41.48,12.79 41.12,13.15 IC2.16
D11  (via drill 0.25)
  Top 0.102: IC2.15 v40.8,12.51 v40.81,12.52 | v43.45,12.52 43.45,14.53 41.62,16.38 v41.62,39.44 | v44.77,42.89 47.77,42.89 X1.37
  Bottom 0.102: v40.81,12.52 v43.45,12.52 | v41.62,39.44 41.62,39.92 42.48,40.77 43.66,40.77 44.16,41.27 44.16,42.28 v44.77,42.89
D12  (via drill 0.25)
  Top 0.102: IC2.14 40.14,11.86 v40.2,11.8 | v44.06,11.8 44.06,14.45 41.92,16.58 41.92,38.83 42.43,39.34 v42.43,39.74 | v44.77,41.67 47.71,41.67 X1.38
  Bottom 0.102: v40.2,11.8 v44.06,11.8 | v42.43,39.74 43.14,40.46 43.85,40.46 44.77,41.37 v44.77,41.67
D13  (via drill 0.25)
  Top 0.102: IC2.13 40.79,11.21 v40.81,11.19 | v43.45,11.19 44.36,11.19 44.67,11.5 44.67,14.45 42.23,16.88 42.23,38.53 v43.45,39.74 | v44.77,40.35 47.77,40.35 X1.39
  Bottom 0.102: v40.81,11.19 v43.45,11.19 | v43.45,39.74 44.16,40.35 v44.77,40.35
D14  (via drill 0.25)
  Top 0.102: IC2.12 40.17,10.56 v40.2,10.59 | v44.06,10.59 44.16,10.59 44.97,11.4 44.97,14.65 42.53,17.09 42.53,38.22 43.35,39.03 47.77,39.03 X1.40
  Bottom 0.102: v40.2,10.59 v44.06,10.59
D15  (via drill 0.25)
  Top 0.102: IC2.11 40.74,9.91 v40.81,9.98 | v44.97,10.48 45.28,10.79 45.28,14.85 42.84,17.29 42.84,37.41 43.24,37.81 47.77,37.81 X1.41
  Bottom 0.102: v40.81,9.98 44.46,9.98 v44.97,10.48
DO0
  Top 0.102: IC4.2 33.2,36.65 33.95,36.65 34.2,36.9 34.2,37.31 33.8,37.71 24.24,37.71 23.94,38.02 23.13,38.02 22.89,38.25 IC1.G6
DO1
  Top 0.102: IC4.3 33.9,35.98 34.51,36.59 34.51,37.31 33.9,37.92 24.45,37.92 24.04,38.32 23.23,38.32 22.9,38.65 22.29,38.65 IC1.F5
DO2
  Top 0.102: IC4.4 33.2,35.35 33.87,35.35 34.81,36.29 34.81,37.31 34,38.12 24.65,38.12 24.14,38.63 23.33,38.63 22.9,39.05 IC1.F6
DO3
  Top 0.102: IC4.5 33.82,34.68 35.12,35.99 35.12,37.31 34.1,38.32 24.75,38.32 24.14,38.93 23.43,38.93 22.91,39.45 22.29,39.45 IC1.E5
DO4
  Top 0.102: IC4.6 33.77,34.03 35.42,35.68 35.42,37.31 31.15,41.57 23.43,41.57 23.01,41.05 22.29,41.05 IC1.D5
DO5
  Top 0.102: IC4.7 33.84,33.38 35.73,35.27 35.73,37.31 31.26,41.78 23.33,41.78 23.01,41.45 IC1.C6
DO6
  Top 0.102: IC4.8 33.8,32.73 36.03,34.97 36.03,37.31 31.36,41.98 23.1,41.98 22.97,41.85 22.29,41.85 IC1.C5
DO7
  Top 0.102: IC1.B6 31.39,42.25 36.34,37.31 36.34,34.66 33.8,32.12 33.23,32.12 IC4.9
DO8  (via drill 0.25)
  Top 0.102: IC3.9 31.92,20.88 | 31.92,20.88 31.36,20.37 31.36,16.45 32.59,15.11 IC2.2 | 31.92,20.88 31.92,21.71 29.39,24.23 29.39,31.65 27.19,33.85 v27.09,33.85 | v17.49,36.86 17.48,37.38 18.36,38.25 IC1.G1
  Bottom 0.102: v27.09,33.85 26.28,34.66 20.99,34.66 18.71,36.92 17.5,36.9 v17.49,36.86
DO9  (via drill 0.25)
  Top 0.102: IC2.3 33.51,14.47 33.9,14.86 33.9,21.23 33.62,21.51 33.24,21.51 IC3.8 32.61,21.53 29.68,24.45 29.68,31.86 27.7,33.85 v27.7,34.87 | IC1.F2 19.09,38.65 18.33,38.65 17.15,37.51 v16.93,37.51
  Bottom 0.102: v27.7,34.87 21.1,34.87 18.35,37.61 v16.93,37.51
DO10  (via drill 0.25)
  Top 0.102: IC2.4 33.71,13.81 34.18,14.27 34.18,21.63 33.49,22.27 33.24,22.17 IC3.7 32.67,22.18 29.99,24.75 29.99,32.07 28.31,33.75 v28.31,34.16 | IC1.F1 17.94,39.05 v17.34,38.45
  Bottom 0.102: v28.31,34.16 28.31,35.07 27.9,35.48 27.39,35.48 26.99,35.07 21.2,35.07 17.89,38.37 17.41,38.37 v17.34,38.45
DO11  (via drill 0.25)
  Top 0.102: IC2.5 33.16,13.18 33.99,13.18 34.44,13.63 34.46,21.96 33.59,22.83 33.34,22.83 IC3.6 32.73,22.83 30.34,25.11 30.34,32.33 28.92,33.75 v28.92,34.87 | IC1.E2 19.49,39.76 19.19,39.45 17.56,39.45 v17.44,39.34
  Bottom 0.102: v28.92,34.87 28.92,35.07 28.31,35.68 27.09,35.68 26.68,35.27 21.3,35.27 18.25,38.32 18.25,38.83 17.74,39.34 v17.44,39.34
DO12  (via drill 0.25)
  Top 0.102: IC2.6 34.2,12.52 34.76,13.08 34.76,22.29 33.59,23.46 33.24,23.46 IC3.5 32.59,23.48 30.68,25.38 30.68,32.6 29.53,33.75 v29.53,34.16 | IC1.D2 19.48,40.65 19.06,41.05 18.35,41.05 18.2,41.01 17.08,41.01 16.73,41.37 v16.42,41.37 16.62,41.37
  Bottom 0.102: v29.53,34.16 29.53,35.78 23.33,41.98 18.56,41.98 17.59,41.01 17.08,41.01 16.73,41.37 v16.42,41.37
DO13  (via drill 0.25)
  Top 0.102: IC2.7 33.16,11.88 34.35,11.88 35.05,12.58 35.07,22.65 33.59,24.12 33.24,24.12 IC3.4 32.65,24.13 31.05,25.72 31.05,32.73 30.14,33.66 v30.14,34.87 | IC1.C1 17.46,41.45 v17.36,41.55
  Bottom 0.102: v17.36,41.55 17.62,41.55 18.25,42.18 23.43,42.18 30.14,35.48 v30.14,34.87
DO14  (via drill 0.25)
  Top 0.102: IC2.8 34.59,11.22 35.34,11.97 35.34,23.04 33.62,24.76 33.24,24.76 IC3.3 32.61,24.78 31.41,25.95 31.41,32.86 30.75,33.55 v30.75,34.16 | IC1.C2 19.09,41.85 17.97,41.85 17.74,42.08 16.52,42.08 v16.42,42.28
  Bottom 0.102: v30.75,34.16 30.75,35.17 23.53,42.39 18.15,42.39 17.84,42.08 16.62,42.08 v16.42,42.28
DO15  (via drill 0.25)
  Top 0.102: IC2.9 34.55,10.56 35.59,11.6 35.59,23.44 33.59,25.42 33.24,25.42 IC3.2 32.67,25.43 31.81,26.29 31.81,32.99 31.36,33.45 v31.36,34.87 | IC1.B1 18.18,42.25 17.84,42.59 v17.34,42.61
  Bottom 0.102: v31.36,34.87 23.64,42.59 v17.34,42.61
GND  (via drill 0.25, 0.5)
  Top 0.102: IC1.B5 22.05,42.25 22.44,42.65 23.3,42.65 23.3,42.67
  Top 0.305: X1.36 45.95,44.14 v45.94,44.23 | IC1.E6 22.97,39.86 23.39,39.44 24.24,39.44 24.43,39.26 C5.2 | C15.2 16.73,40.65 IC1.D1 17.43,40.65 v17.23,40.46 | 23.3,42.67 23.43,42.79
  Top 0.406: X1.1 47.87,46.04 v45.92,46.02 | X1.36 48.17,44.14 | X1.34 47.84,4.13 v46.23,4.13
  other vias: 44.56,47.47 36.91,2.84 38.47,47.57 38.87,41.47 30.8,36.54 45.48,24 43.85,23.08 36.23,39.85 31.46,39.54 33.29,27.35 25.77,32.94 28.92,14.34 30.85,15.77 36.64,16.78 44.56,19.53 36.94,9.87 37.15,6.52 24.35,6.62 19.47,8.25 17.13,12.92 12.15,16.48 23.94,33.85 15,27.35 8.19,33.14 3.42,18.31 21.81,27.04 22.82,25.42 21.81,22.57 33.19,16.88 26.68,45.03 9.61,10.59 11.54,11.4 9.11,39.54 7.28,48.28 18.66,48.28 28.51,48.18 40.7,27.55 39.79,17.8 31.01,3.04 30,7.31 22.17,3.24 12.62,3.14 15.57,7.31 6.32,3.55 2.77,6.39 10.22,27.35 13.58,33.14 45.28,35.27 26.99,15.67 34.91,27.25 21.6,45.84 24.85,36.39 14.69,45.94 7.07,45.13 9.21,23.69 26.58,36.39 29.53,39.54
  pour Top (isolate 0.254): -0.41,49.94 51.52,49.85 51.52,-0.41 -0.51,-0.25
  pour Bottom (isolate 0.254): -0.41,49.85 51.52,49.96 51.52,-0.32 -0.41,-0.43
L_OE
  Top 0.102: IC6.18 20.07,18.32 18.66,19.83 18.66,34.66 15.61,37.61 15.61,43.5 16.62,44.52 18.25,44.52 19.49,43.28 IC1.A2
L_WE  (via drill 0.25)
  Top 0.102: 20.2,20.92 IC6.14 21.53,20.92 23.23,19.22 v23.43,19.12 | IC4.1 32.68,37.28 | IC2.1 32.07,16.85 v32.07,20.24 | v36.13,20.24 35.83,20.44 35.83,23.79 33.59,26.03 33.24,26.03 IC3.1 32.73,26.08 32.17,26.64 32.17,36.78 32.68,37.28 | IC1.G5 22.08,38.25 22.48,37.85 22.89,37.85 23.03,37.71 23.94,37.71 24.14,37.51 32.45,37.51 32.68,37.28
  Bottom 0.102: v36.13,20.24 v32.07,20.24 30.95,20.24 30.85,20.14 28,20.14 27.19,19.32 23.53,19.32 v23.43,19.12
LA1
  Top 0.102: IC5.12 20.15,12.95 19.67,13.43 19.67,17.9 18.25,19.32 18.25,34.36 15.2,37.41 15.2,43.71 16.42,44.93 18.96,44.93 20.28,43.61 IC1.A3
LA2
  Top 0.102: IC5.14 20.13,11.65 19.27,12.52 19.27,17.7 17.84,19.12 17.84,34.16 14.8,37.2 14.8,43.91 16.22,45.33 19.37,45.33 21.1,43.61 IC1.A4
LA3
  Top 0.102: IC5.16 20.21,10.35 18.86,11.7 18.86,17.49 17.44,18.92 17.44,33.95 14.39,37 14.39,44.11 16.02,45.74 19.72,45.74 21.88,43.58 IC1.A5
LA4
  Top 0.102: IC1.B3 20.29,42.43 19.89,42.83 19.89,43.29 18.45,44.72 16.52,44.72 15.41,43.61 15.41,37.51 18.45,34.46 18.45,19.42 19.88,18 19.88,15.46 20.63,14.7 IC5.11
LA5
  Top 0.102: IC5.15 20.17,11 19.06,12.11 19.06,17.6 17.64,19.02 17.64,34.05 14.59,37.1 14.59,44.01 16.12,45.54 19.47,45.54 21.49,43.52 21.49,42.84 21.09,42.43 IC1.B4
LA6
  Top 0.102: IC6.17 20.13,18.97 18.86,20.24 18.86,34.77 15.81,37.71 15.81,43.4 16.73,44.32 18.07,44.32 19.09,43.3 19.09,42.87 19.3,42.65 19.71,42.65 19.89,42.47 19.89,41.81 20.25,41.45 IC1.C3
LA7
  Top 0.102: IC5.17 20.15,9.7 18.66,11.19 18.66,17.39 17.23,18.81 17.23,33.85 14.19,36.9 14.19,44.21 15.91,45.94 19.88,45.94 22.29,43.52 22.29,42.88 22.07,42.65 21.67,42.65 21.49,42.47 21.49,41.85 IC1.C4
LA8  (via drill 0.25)
  Top 0.102: IC7.18 21.22,27.37 23.33,29.48 23.33,32.94 22.72,33.55 22.72,36.19 v23.64,37.1 | v23.64,40.18 23.53,40.25 21.53,40.25 21.13,40.65 IC1.D4
  Bottom 0.102: v23.64,37.1 v23.64,40.18
LA9
  Top 0.102: IC6.12 20.13,22.22 19.67,22.68 19.67,36.52 19.49,36.7 IC1.H2
LA10
  Top 0.102: IC7.11 20.63,31.87 20.28,32.23 IC1.H3
LA11
  Top 0.102: IC7.13 21.32,30.62 21.81,31.11 21.81,32.23 21.1,32.94 IC1.H4
LA12
  Top 0.102: IC7.15 21.24,29.32 22.42,30.5 22.42,32.43 21.81,33.04 21.81,37.37 IC1.H5
LA13
  Top 0.102: IC6.11 20.19,22.87 19.88,23.08 19.88,36.95 19.89,36.96 19.89,37.67 20.29,38.07 IC1.G3
LA14
  Top 0.102: IC7.14 21.28,29.97 22.11,30.8 22.11,32.33 21.49,32.94 21.49,37.61 21.09,38.02 IC1.G4
LA15
  Top 0.102: IC6.13 20.17,21.57 19.47,22.27 19.47,36.16 19.09,36.52 19.09,37.64 19.32,37.85 19.72,37.85 19.89,38 19.89,38.65 IC1.F3
LA16
  Top 0.102: IC1.F4 21.49,38.66 21.49,38.04 21.68,37.85 22.07,37.85 22.29,37.62 22.29,37.08 22.11,36.9 22.11,33.14 22.72,32.53 22.72,30.19 21.2,28.67 IC7.16
LA17
  Top 0.102: IC7.12 21.26,31.27 21.5,31.51 21.5,32.12 20.69,32.94 20.69,39.45 IC1.E4
LA18
  Top 0.102: IC5.13 20.19,12.3 19.47,13.02 19.47,17.8 18.05,19.22 18.05,34.26 15,37.31 15,43.81 16.32,45.13 19.16,45.13 20.69,43.61 20.69,41.05 IC1.D3
LA19
  Top 0.102: IC6.15 20.15,20.27 19.27,21.15 19.27,35.88 18.68,36.47 IC1.H1
LA20
  Top 0.102: IC6.16 20.09,19.62 19.06,20.64 19.06,35.58 18.05,36.59 18.05,37.46 18.44,37.85 18.92,37.85 19.32,38.25 IC1.G2
LA21
  Top 0.102: IC7.17 21.26,28.02 23.03,29.79 23.03,32.73 22.42,33.34 22.42,36.59 22.7,36.87 IC1.H6
N$8
  Top 0.102: 4.95,24.05 4.95,22.1 1.8,18.98 1.8,15.69 2.31,15.18 3.28,15.18
  Top 0.15: SW1.2 3.94,25.03 4.95,24.05 | 3.28,15.18 IC8.14
OE  (via drill 0.25)
  Top 0.102: X1.9 44.11,35.88 43.17,35.05 43.17,19.89 v43.47,19.7 | IC8.16 4.54,13.57 v6.03,12.08 | v6.85,13.51 6.83,14.97 v7.49,15.63 | IC6.2 v27.88,17.67
  Bottom 0.102: v6.03,12.08 6.85,12.9 v6.85,13.51 | v7.49,15.63 7.49,17.5 9.11,19.12 15.91,19.12 16.22,19.42 22.31,19.42 23.23,18.51 23.64,18.51 24.14,19.02 26.55,19.02 27.88,17.69 v27.88,17.67 28.89,17.67 29.93,18.71 41.82,18.71 42.84,19.73 43.33,19.73 v43.47,19.7
OE_EVEN  (via drill 0.25)
  Top 0.102: IC4.19 v37.58,36.63 v37.57,36.65 | v8.46,8.42 8.47,6.8
  Top 0.15: 8.47,6.8 IC8.27
  Bottom 0.102: v37.57,36.65 37.54,36.65 33.57,32.67 27.53,32.67 26.28,31.41 8.34,31.41 5.82,28.89 5.8,15.39 8.46,12.74 v8.46,8.42
OE_ODD
  Top 0.102: IC2.19 37.43,15.11 36.28,13.96 36.28,11.3 29.46,4.48 10.92,4.48 8.22,1.78 5.96,1.78 4.25,3.5 4.25,7.21 3.33,8.13 3.33,8.74
  Top 0.15: 3.33,8.74 IC8.22
OE_ODD_LOW  (via drill 0.25)
  Top 0.102: IC8.23 5.3,2.99 6.03,2.26 8.12,2.26 10.76,4.9 29.33,4.9 35.87,11.45 35.87,19.3 36.74,20.03 36.74,20.44 36.07,21.13 36.07,24.38 v35.78,24.66 | v40.17,25.79 v40.18,25.79 39.8,25.41 39.05,25.41 IC3.19
  Bottom 0.102: v35.78,24.66 36.94,25.83 40.11,25.83 v40.17,25.79
REG#  (via drill 0.25)
  Top 0.102: X1.61 46.08,12.39 45.56,11.89 45.56,10.99 45.66,10.89 45.66,9.64 v44.98,9.06 | v13.52,11.15 15.28,11.15
  Top 0.15: 15.28,11.15 IC8.37
  Bottom 0.102: v44.98,9.06 44.98,5.56 44.32,4.9 16.57,4.9 13.2,8.26 13.2,10.83 v13.52,11.15
TCK
  Top 0.102: JTAG.3 4.26,36.39 5.02,35.64 5.02,30.25 5.33,29.94 5.33,18.8
  Top 0.15: 5.33,18.8 IC8.11
TDI
  Top 0.102: JTAG.5 3.14,41.47 4.86,39.74 4.86,38.19 5.79,37.26 5.78,30.46 6.88,29.36 6.88,18.78
  Top 0.15: 6.88,18.78 IC8.9
TDO  (via drill 0.25)
  Top 0.102: IC8.24 6.1,8.59
  Top 0.15: 6.1,8.59 v6.12,8.61
  Bottom 0.102: 6.12,8.67 4.72,10.08 4.72,33.18 4.05,33.85 JTAG.2 2.91,33.85
  Bottom 0.15: v6.12,8.61 6.12,8.67
TMS
  Top 0.102: JTAG.4 3.6,38.93 5.4,37.13 5.4,30.35 6.09,29.66 6.09,18.78
  Top 0.15: 6.09,18.78 IC8.10
WE  (via drill 0.25)
  Top 0.102: v28.7,25.29 29.1,24.84 29.1,22.44 26.89,20.23 26.51,20.23 | X1.15 46.16,28.26 v46.24,28.24
  Top 0.15: 26.51,20.23 IC6.6
  Bottom 0.102: v46.24,28.24 46.09,28.37 45.4,28.35 44.87,28.87 31.38,28.87 29.84,27.35 29.84,26.43 v28.7,25.29

### Text on the board
tNames: SAKURA 4MB SRAM v2.2 | K:/Amiga projekty/sakuralogo_bw.bmp
bNames: SAKURA | v2.2 | by strim_ & jarob 2015